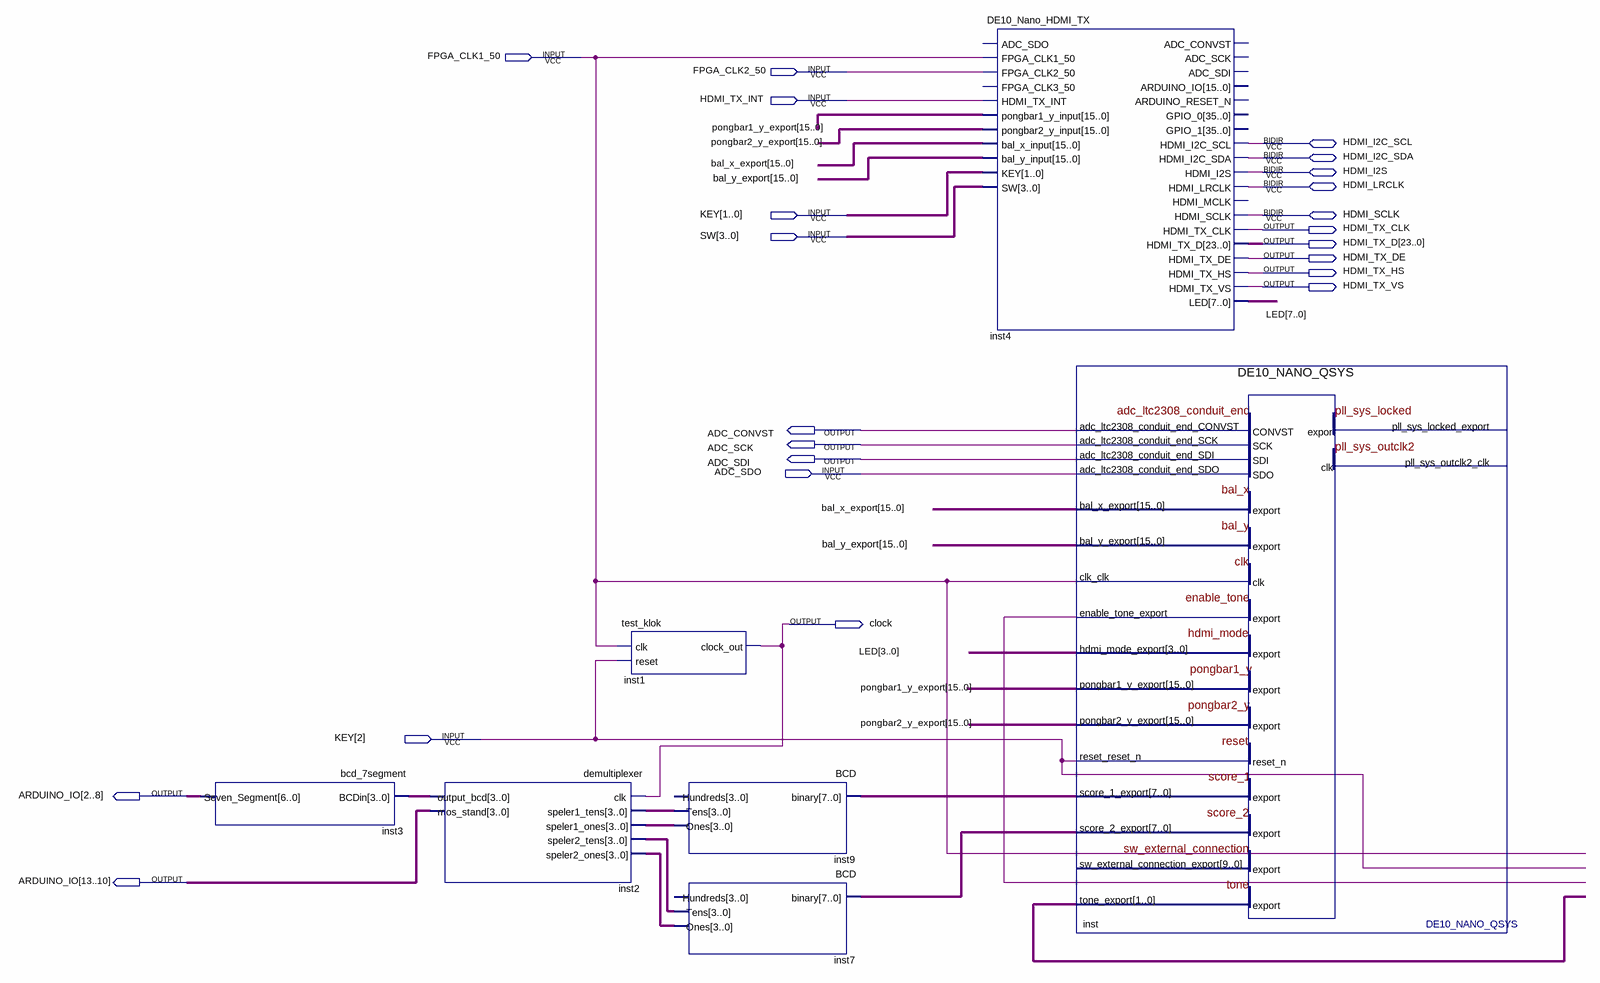
[diagram p0: schematic sheet]
// Quartus schematic main.bdf as structural Verilog: 7 symbols, 23 pins
module main (
  input  FPGA_CLK1_50,
  input  FPGA_CLK2_50,
  input  HDMI_TX_INT,
  input  [2:0] KEY,
  input  [3:0] SW,
  input  ADC_SDO,
  inout  HDMI_I2C_SCL,
  inout  HDMI_I2C_SDA,
  inout  HDMI_I2S,
  inout  HDMI_LRCLK,
  inout  HDMI_SCLK,
  output HDMI_TX_CLK,
  output [23:0] HDMI_TX_D,
  output HDMI_TX_DE,
  output HDMI_TX_HS,
  output HDMI_TX_VS,
  output ADC_CONVST,
  output ADC_SCK,
  output ADC_SDI,
  output clock,
  output [2:13] ARDUINO_IO
);

  wire inst_enable_tone_export;
  wire [1:0] inst_tone_export;
  wire [3:0] inst2_output_bcd, inst7_ones, inst7_tens, inst9_ones, inst9_tens;
  wire [7:0] inst_score_1_export, inst_score_2_export, LED;
  wire [15:0] bal_x_export, bal_y_export, pongbar1_y_export, pongbar2_y_export;

  bcd_7segment inst3 (.BCDin(inst2_output_bcd), .Seven_Segment(ARDUINO_IO[2:8]));
  demultiplexer inst2 (
    .clk(clock), .speler1_tens(inst9_tens), .speler1_ones(inst9_ones), .speler2_tens(inst7_tens),
    .speler2_ones(inst7_ones), .output_bcd(inst2_output_bcd),
    .mos_stand({ARDUINO_IO[13], ARDUINO_IO[12], ARDUINO_IO[11], ARDUINO_IO[10]}));
  test_klok inst1 (.clk(FPGA_CLK1_50), .reset(KEY[2]), .clock_out(clock));
  BCD inst9 (.binary(inst_score_1_export), .Tens(inst9_tens), .Ones(inst9_ones));  // open: Hundreds
  BCD inst7 (.binary(inst_score_2_export), .Tens(inst7_tens), .Ones(inst7_ones));  // open: Hundreds
  DE10_Nano_HDMI_TX inst4 (
    .FPGA_CLK1_50(FPGA_CLK1_50), .FPGA_CLK2_50(FPGA_CLK2_50), .HDMI_TX_INT(HDMI_TX_INT),
    .pongbar1_y_input(pongbar1_y_export), .pongbar2_y_input(pongbar2_y_export), .bal_x_input(bal_x_export),
    .bal_y_input(bal_y_export), .KEY(KEY[1:0]), .SW(SW), .HDMI_TX_CLK(HDMI_TX_CLK), .HDMI_TX_D(HDMI_TX_D),
    .HDMI_TX_DE(HDMI_TX_DE), .HDMI_TX_HS(HDMI_TX_HS), .HDMI_TX_VS(HDMI_TX_VS), .LED(LED),
    .HDMI_I2C_SCL(HDMI_I2C_SCL), .HDMI_I2C_SDA(HDMI_I2C_SDA), .HDMI_I2S(HDMI_I2S), .HDMI_LRCLK(HDMI_LRCLK),
    .HDMI_SCLK(HDMI_SCLK));  // open: ADC_SDO, FPGA_CLK3_50, ADC_CONVST, ADC_SCK, ADC_SDI, ARDUINO_IO, ARDUINO_RESET_N, GPIO_0, GPIO_1, HDMI_MCLK
  DE10_NANO_QSYS inst (
    .adc_ltc2308_conduit_end_SDO(ADC_SDO), .clk_clk(FPGA_CLK1_50), .hdmi_mode_export(LED[3:0]),
    .reset_reset_n(KEY[2]), .adc_ltc2308_conduit_end_CONVST(ADC_CONVST),
    .adc_ltc2308_conduit_end_SCK(ADC_SCK), .adc_ltc2308_conduit_end_SDI(ADC_SDI),
    .bal_x_export(bal_x_export), .bal_y_export(bal_y_export), .enable_tone_export(inst_enable_tone_export),
    .pongbar1_y_export(pongbar1_y_export), .pongbar2_y_export(pongbar2_y_export),
    .score_1_export(inst_score_1_export), .score_2_export(inst_score_2_export), .tone_export(inst_tone_export));  // open: sw_external_connection_export, pll_sys_locked_export, pll_sys_outclk2_clk
endmodule
